# Altium project DTCP v2.0.PrjPcb (part 1 of 2)
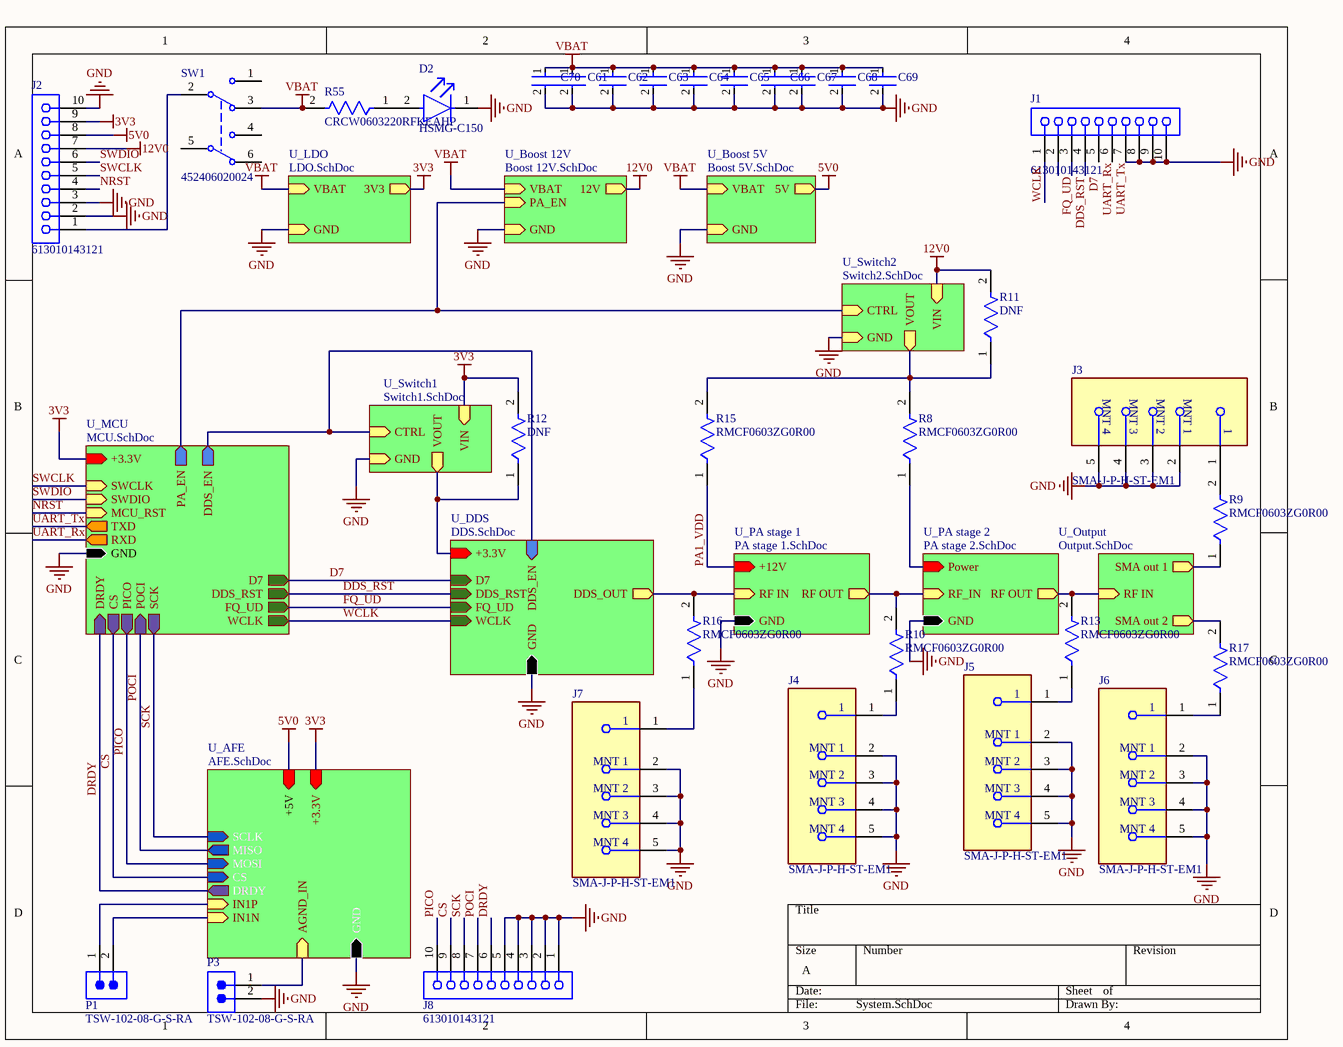
[diagram p0: System.SchDoc]
10 sheets, 150 parts. Net scope: hierarchical (ports join the sheet entries above them; power ports are global).
Board file: PCB1.PcbDoc
Sheets:
  System.SchDoc
    U_MCU = MCU.SchDoc
    U_DDS = DDS.SchDoc
    U_PA stage 1 = PA stage 1.SchDoc
    U_PA stage 2 = PA stage 2.SchDoc
    U_Output = Output.SchDoc
    U_Boost 12V = Boost 12V.SchDoc
    U_Switch1 = Switch1.SchDoc
    U_Boost 5V = Boost 5V.SchDoc
    U_AFE = AFE.SchDoc

## Sheet System.SchDoc
size A; SheetNumber: 1; SheetTotal: 12

### Parts
C61  GRM21BR60J107ME15K  [FP-GRM21B-0_2-e0_2_0_7-IPC_B]  (value not drawn)
C62  GRM21BR60J107ME15K  [FP-GRM21B-0_2-e0_2_0_7-IPC_B]  (value not drawn)
C63  GRM21BR60J107ME15K  [FP-GRM21B-0_2-e0_2_0_7-IPC_B]  (value not drawn)
C64  GRM21BR60J107ME15K  [FP-GRM21B-0_2-e0_2_0_7-IPC_B]  (value not drawn)
C65  GRM21BR60J107ME15K  [FP-GRM21B-0_2-e0_2_0_7-IPC_B]  (value not drawn)
C66  GRM21BR60J107ME15K  [FP-GRM21B-0_2-e0_2_0_7-IPC_B]  (value not drawn)
C67  GRM21BR60J107ME15K  [FP-GRM21B-0_2-e0_2_0_7-IPC_B]  (value not drawn)
C68  GRM21BR60J107ME15K  [FP-GRM21B-0_2-e0_2_0_7-IPC_B]  (value not drawn)
C69  GRM21BR60J107ME15K  [FP-GRM21B-0_2-e0_2_0_7-IPC_B]  (value not drawn)
C70  GRM21BR60J107ME15K  [FP-GRM21B-0_2-e0_2_0_7-IPC_B]  (value not drawn)
D2  HSMG-C150  [FP-HSMG-C150-MFG]
J1  613010143121  [613010143121]
J2  613010143121  [613010143121]
J3  SMA-J-P-H-ST-EM1  [FP-SMA-J-P-H-ST-EM1-MFG]
J4  SMA-J-P-H-ST-EM1  [FP-SMA-J-P-H-ST-EM1-MFG]
J5  SMA-J-P-H-ST-EM1  [FP-SMA-J-P-H-ST-EM1-MFG]
J6  SMA-J-P-H-ST-EM1  [FP-SMA-J-P-H-ST-EM1-MFG]
J7  SMA-J-P-H-ST-EM1  [FP-SMA-J-P-H-ST-EM1-MFG]
J8  613010143121  [613010143121]
P1  TSW-102-08-G-S-RA  [SMTC-TSW-102-08-X-S-RA]
P3  TSW-102-08-G-S-RA  [SMTC-TSW-102-08-X-S-RA]
R8  RMCF0603ZG0R00  [FP-RMCF0603-IPC_B]
R9  RMCF0603ZG0R00  [FP-RMCF0603-IPC_B]
R10  RMCF0603ZG0R00  [FP-RMCF0603-IPC_B]
R11  DNF  [FP-RMCF0603-IPC_B]
R12  DNF  [FP-RMCF0603-IPC_B]
R13  RMCF0603ZG0R00  [FP-RMCF0603-IPC_B]
R15  RMCF0603ZG0R00  [FP-RMCF0603-IPC_B]
R16  RMCF0603ZG0R00  [FP-RMCF0603-IPC_B]
R17  RMCF0603ZG0R00  [FP-RMCF0603-IPC_B]
R55  CRCW0603220RFKEAHP  [FP-CRCW0603-HPe3-IPC_A]
SW1  452406020024  [452406020024]

### Sub-sheets
U_AFE = AFE.SchDoc: +5V (in), GND (in), +3.3V (in), DRDY (out), CS (in), SCLK (in), MISO (out), MOSI (in), IN1P (in), IN1N (in), AGND_IN (in)
U_Boost 5V = Boost 5V.SchDoc: VBAT (in), GND (in), 5V (out)
U_Boost 12V = Boost 12V.SchDoc: VBAT (in), GND (in), 12V (out), PA_EN (in)
U_DDS = DDS.SchDoc: DDS_OUT (out), D7 (in), DDS_RST (in), FQ_UD (in), WCLK (in), +3.3V (in), GND (in), DDS_EN (in)
U_LDO = LDO.SchDoc (file not in this document): VBAT (in), GND (in), 3V3 (out)
U_MCU = MCU.SchDoc: +3.3V (in), GND (in), SWCLK (in), SWDIO (in), MCU_RST (in), TXD (out), CS (out), PICO (out), POCI (in), SCK (out), D7 (out), DDS_RST (out), FQ_UD (out), WCLK (out), PA_EN (out), DDS_EN (out), DRDY (in), RXD (out)
U_Output = Output.SchDoc: RF IN (in), SMA out 1 (out), SMA out 2 (out)
U_PA stage 1 = PA stage 1.SchDoc: RF IN (in), RF OUT (out), GND (in), +12V (in)
U_PA stage 2 = PA stage 2.SchDoc: GND (in), RF OUT (out), Power (in), RF_IN (in)
U_Switch1 = Switch1.SchDoc: VOUT (out), CTRL (in), GND (in), VIN (in)
U_Switch2 = Switch2.SchDoc (file not in this document): VIN (in), VOUT (out), CTRL (in), GND (in)

### Nets
3V3: J2.9 R12.2 ; sheet U_MCU/+3.3V, sheet U_LDO/3V3, sheet U_Switch1/VIN, sheet U_AFE/+3.3V
3V3DDS: R12.1 ; sheet U_DDS/+3.3V, sheet U_Switch1/VOUT
5V0: J2.8 ; sheet U_Boost 5V/5V, sheet U_AFE/+5V
12V0: J2.7 R11.2 ; sheet U_Boost 12V/12V, sheet U_Switch2/VIN
13V0PA: R8.1 ; sheet U_PA stage 2/Power
GND: C61.2 C62.2 C63.2 C64.2 C65.2 C66.2 C67.2 C68.2 C69.2 C70.2 D2.1(C) J1.7 J1.8 J1.9 J1.10 J2.2 J2.3 J2.10 J3.2(MNT_1) J3.3(MNT_2) J3.4(MNT_3) J3.5(MNT_4) J4.2(MNT_1) J4.3(MNT_2) J4.4(MNT_3) J4.5(MNT_4) J5.2(MNT_1) J5.3(MNT_2) J5.4(MNT_3) J5.5(MNT_4) J6.2(MNT_1) J6.3(MNT_2) J6.4(MNT_3) J6.5(MNT_4) J7.2(MNT_1) J7.3(MNT_2) J7.4(MNT_3) J7.5(MNT_4) J8.1 J8.2 J8.3 J8.4 J8.5 P3.2 ; sheet U_MCU/GND, sheet U_DDS/GND, sheet U_PA stage 1/GND, sheet U_PA stage 2/GND, sheet U_LDO/GND, sheet U_Boost 12V/GND, sheet U_Switch1/GND, sheet U_Switch2/GND, sheet U_Boost 5V/GND, sheet U_AFE/GND
VBAT: C61.1 C62.1 C63.1 C64.1 C65.1 C66.1 C67.1 C68.1 C69.1 C70.1 R55.2 SW1.3 ; sheet U_LDO/VBAT, sheet U_Boost 12V/VBAT, sheet U_Boost 5V/VBAT
CS: J8.9 ; sheet U_MCU/CS, sheet U_AFE/CS
D7: J1.4 ; sheet U_MCU/D7, sheet U_DDS/D7
DDS_OUT: R16.2 ; sheet U_DDS/DDS_OUT, sheet U_PA stage 1/RF IN
DDS_RST: J1.3 ; sheet U_MCU/DDS_RST, sheet U_DDS/DDS_RST
DRDY: J8.6 ; sheet U_MCU/DRDY, sheet U_AFE/DRDY
FQ_UD: J1.2 ; sheet U_MCU/FQ_UD, sheet U_DDS/FQ_UD
IN+: P1.1 ; sheet U_AFE/IN1P
IN-: P1.2 ; sheet U_AFE/IN1N
NRST: J2.4 ; sheet U_MCU/MCU_RST
PA1_VDD: R15.1 ; sheet U_PA stage 1/+12V
PICO: J8.10 ; sheet U_MCU/PICO, sheet U_AFE/MOSI
POCI: J8.7 ; sheet U_MCU/POCI, sheet U_AFE/MISO
SCK: J8.8 ; sheet U_MCU/SCK, sheet U_AFE/SCLK
SWCLK: J2.5 ; sheet U_MCU/SWCLK
SWDIO: J2.6 ; sheet U_MCU/SWDIO
UART_Rx: J1.5 ; sheet U_MCU/RXD
UART_Tx: J1.6 ; sheet U_MCU/TXD  [project net TXD]
WCLK: J1.1 ; sheet U_MCU/WCLK, sheet U_DDS/WCLK  [project net DDS_WCLK]
NetC33_2: R10.2 ; sheet U_PA stage 1/RF OUT, sheet U_PA stage 2/RF_IN
NetC40_2: R13.2 ; sheet U_PA stage 2/RF OUT, sheet U_Output/RF IN
NetD2_2: D2.2(A) R55.1
NetJ2_1: J2.1 SW1.2(COM)
NetJ3_1: J3.1 R9.2
NetJ4_1: J4.1 R10.1
NetJ5_1: J5.1 R13.1
NetJ6_1: J6.1 R17.1
NetJ7_1: J7.1 R16.1
NetL14_1: R9.1 ; sheet U_Output/SMA out 1
NetL15_1: R17.2 ; sheet U_Output/SMA out 2
NetP3_1: P3.1 ; sheet U_AFE/AGND_IN
NetR8_2: R8.2 R11.1 R15.2 ; sheet U_Switch2/VOUT
NetR14_1: sheet U_MCU/PA_EN, sheet U_Boost 12V/PA_EN, sheet U_Switch2/CTRL
NetU1_8: sheet U_MCU/DDS_EN, sheet U_DDS/DDS_EN, sheet U_Switch1/CTRL

Not connected (* = marked no-connect by the designer): SW1 1 4 5(COM) 6

### Library data of the parts
C61-C70 = CMP-06035-052658-1: Chip Multilayer Ceramic Capacitors for General Purpose, 0805, 100uF, X5R, 15%, 20%, 6.3V; Voltage Rating (DC): 6.3V; Lead Free: Lead Free; Length: 2mm; Tolerance: 20%; Width: 1.25mm; Capacitance: 100uF; Dielectric: X5R; Thickness: 1.25mm
D2 = CMP-2000-05061-2: LED GREEN DIFFUSED 1206 SMD; Manufacturer: Broadcom; Led Orientation: Top View; Max Junction Temp: +95°C; Peak Emmision Wavelength: 570nm; Viewing Angle: 170°; Wavelength: 572nm; Reverse Voltage: 5V; Luminous Intensity: 15mcd; Forward Voltage: 2.2V; Power Dissipation: 65mW; Forward Current: 20mA; ComponentLink2Description: Datasheet; Lead Free: Yes; Temperature Range Low: -40°C; Package: HSMG-C150; Digikey Description: LED GREEN DIFFUSED 1206 SMD; Mouser Description: LED Uni-Color Green 570nm 2-Pin Chip LED T/R; Manufacturer Part Number: HSMG-C150; Temperature Range High: +85°C; Device Class L1: Optoelectronics; Colour: Green; Category: Diode; Device Class L3: unset; RoHS: TRUE; Height: 1.2mm; ComponentLink2URL: https://docs.broadcom.com/docs/AV02-0551EN; Device Class L2: LEDs; Automotive: No; Ipc Land Pattern Name: DIOCP320160X55; Octopart: https://octopart.com/hsmg-c150-broadcom-71131304; Temperature: -40°C to +85°C
J1 J2 J8 = CMP-1502-01419-3: NexarPartId: 18818161; Operating Supply Voltage: 250V; Contact Resistance: 20mΩ; Gender: Female; Insulation Resistance: 1GΩ; Connector Type: Header, Socket; Insulation: Insulated; Current Rating: 3A; Number of Positions: 10; Pitch: 2.54mm; Number of Rows: 1; Number of Pins: 10; Voltage Rating: 250V; Length: 25.9mm; Contact Gender: Female; RoHS: Compliant; Contact Plating: Gold; Height: 8.5mm; Min Operating Temperature: -40°C; Contact Material: Copper; Number of Contacts: 10; REACH SVHC: Unknown; Mount: Through Hole; Lead Pitch: 2.54mm; Width: 25.9mm; Max Operating Temperature: 125°C; Flammability Rating: UL94 V-0; Termination: Through Hole; Color: Black; Housing Material: PBT
J3-J7 = CMP-02754-000006-1: CONN SMA JACK STR 50OHM EDGE MNT; Dielectric Material: PTFE; Center Contact Plating: Gold; Max Frequency: 6GHz; Body Material: Brass; Voltage Rating: 335V; Impedance: 50R; Package Quantity: 1; Case/Package: SMA; Max Operating Temperature: 125°C; Fastening Type: Threaded; Orientation: Straight; Depth: 13.33mm; RoHS Compliant: Yes; Length: 6.35mm; Insulation Material: Polytetrafluoroethylene; Termination: Solder; Min Operating Temperature: -65°C; Housing Color: Gold; Contact Plating: Gold; Contact Material: Copper; Connector Type: SMA; Mount: Edge; Series: SMA; Packaging: Tray; Body Plating: Gold; Radiation Hardening: No
P1 P3 = CMP-1024-00320-1: 0.025" SQ Post Header, Through-hole, Right Angle, -55 to 125 degC, 2.54 mm Pitch, 2-Pin, Male, RoHS; Manufacturer: Samtec; Pitch: 2.54 mm; Temperature Range: -55 to 125 degC; PackageDescription: .025[0.64] SQ. Post Terminal Strip Assembly; ComponentLink3Description: Package Specification; ComponentLink2Description: Datasheet; PackageReference: TSW-102-08-X-S-RA; ComponentLink1Description: Manufacturer URL; ComponentLink2URL: http://www.samtec.com/documents/webfiles/pdf/TSW_TH.PDF; PackageVersion: DM, 8/1988; RoHS: True; PartNumber: TSW-102-08-G-S-RA; Mounting Technology: Through-hole; Orientation: Right Angle; ComponentLink1URL: http://www.samtec.com; DatasheetVersion: F-214; ComponentLink3URL: http://www.samtec.com/documents/webfiles/cpdf/TSW-XXX-XX-XXX-X-XX-XXX-MKT.pdf
R8-R13 R15-R17 = CMP-26527-006412-1: 0Ω ±0 0.1W 0603 Thick Film Chip Resistor AEC-Q200 compliant; Max Power Dissipation: 100mW; Resistance: 0R; Width: 0.031inch; RoHS Compliant: Yes; Number of Terminations: 2; Case/Package: 0603; Contact Plating: Tin; Height: 0.022inch; Resistor Type: Thick Film; Mount: Surface Mount; Length: 0.061inch; Features: Automotive AEC-Q200; Series: RMCF; Max Operating Temperature: 155°C; Radiation Hardening: No; Min Operating Temperature: -55°C; Packaging: Tape and Reel
R55 = CMP-02407-003593-1: RES Thick Film, 220Ω, 1%, 0.33W, 100ppm/°C, 0603; Max Power Dissipation: 250mW; Voltage Rating (DC): 75V; Resistance: 220R; Radiation Hardening: No; Contact Plating: Tin; Length: 1.6mm; Depth: 0.85mm; Composition: Thick Film; Lead Free: Lead Free; Mount: Surface Mount; Package Quantity: 5000; Height: 0.45mm; Termination: SMD/SMT; Weight: 7.1E-05oz; Military Standard: Not; Number of Terminations: 2; Case Code (Metric): 1608; Max Operating Temperature: 155°C; Power Rating: 250mW; Tolerance: 1%; Temperature Coefficient: 100ppm/°C; Features: Automotive AEC-Q200; Case Code (Imperial): 0603; Width: 0.033inch; Min Operating Temperature: -55°C; Case/Package: 0603; Voltage Rating: 75V; Packaging: Tape and Reel
SW1 = CMP-03913-146831046-1: Ws-slsv_smt Mini Slide Switch Sa

## Sheet MCU.SchDoc
size A; SheetNumber: 2; SheetTotal: 12
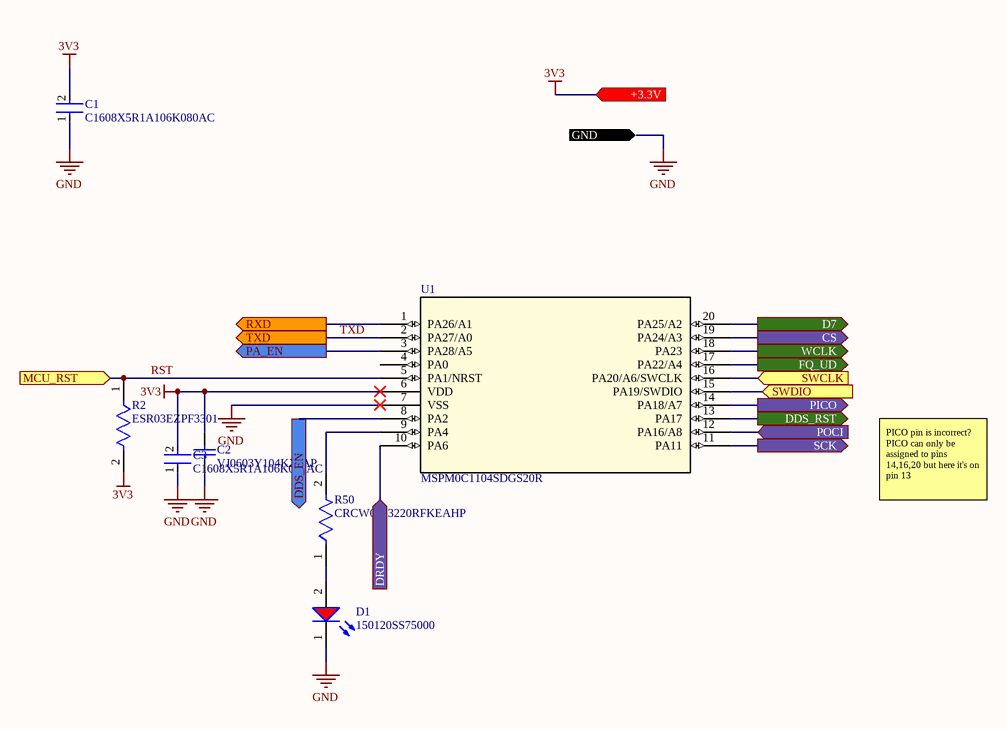
[diagram p1: MCU.SchDoc]

### Parts
C1  C1608X5R1A106K080AC  [FP-C1608-080-0_1-MFG]
C2  VJ0603Y104KXJAP  [CAPC1608X92X38NL15T08]
C3  C1608X5R1A106K080AC  [FP-C1608-080-0_1-MFG]
D1  150120SS75000  [WL-SMCW_1206_150120xx75000]
R2  ESR03EZPF3301  [FP-ESR03-IPC_A]
R50  CRCW0603220RFKEAHP  [FP-CRCW0603-HPe3-IPC_A]
U1  MSPM0C1104SDGS20R  [DGS0020A_TEX]

### Ports
+3.3V (in), CS (out), D7 (out), DDS_EN (out), DDS_RST (out), DRDY (in), FQ_UD (out), GND (in), MCU_RST (in), PA_EN (out), PICO (out), POCI (in), RXD (out), SCK (out), SWCLK (in), SWDIO (in), TXD (out), WCLK (out)

### Nets
3V3: C1.2 C2.2 C3.2 R2.2 U1.6(VDD) ; port +3.3V
GND: C1.1 C2.1 C3.1 D1.1(K) U1.7(VSS) ; port GND
CS: U1.19(PA24/A3) ; port CS
D7: U1.20(PA25/A2) ; port D7
DDS_RST: U1.13(PA17) ; port DDS_RST
DDS_WCLK: U1.18(PA23) ; port WCLK
DRDY: U1.10(PA6) ; port DRDY
FQ_UD: U1.17(PA22/A4) ; port FQ_UD
PICO: U1.14(PA18/A7) ; port PICO
POCI: U1.12(PA16/A8) ; port POCI
RST: R2.1 U1.5(PA1/NRST) ; port MCU_RST  [project net NRST]
SCK: U1.11(PA11) ; port SCK
SWCLK: U1.16(PA20/A6/SWCLK) ; port SWCLK
SWDIO: U1.15(PA19/SWDIO) ; port SWDIO
TXD: U1.2(PA27/A0) ; port TXD
UART_Rx: U1.1(PA26/A1) ; port RXD
NetD1_2: D1.2(A) R50.1
NetR14_1: U1.3(PA28/A5) ; port PA_EN
NetR50_2: R50.2 U1.9(PA4)
NetU1_8: U1.8(PA2) ; port DDS_EN

Not connected (* = marked no-connect by the designer): U1 4(PA0)

### Notes on the sheet
- PICO pin is incorrect? PICO can only be assigned to pins 14,16,20 but here it's on pin 13

### Library data of the parts
C1 C3 = CMP-2000-04979-3: Multilayer Ceramic Capacitors 10μF ±10% 10V X5R SMD 0603; Capacitance: 10uF; Dielectric Material: Ceramic; Construction: Flat; Height: 0.8mm; Thickness: 0.035inch; Case Code (Metric): 1608; Radiation Hardening: No; Number of Pins: 2; Voltage Rating (DC): 10V; Depth: 0.8mm; Voltage: 10V; RoHS Compliant: Yes; Voltage Rating: 10V; Package Quantity: 1; Resistor Type: Ceramic; Termination: SMD/SMT; Lead Free: Lead Free; REACH SVHC: No SVHC; Tolerance: 10%; Mount: Surface Mount; Series: C; Packaging: Tape and Reel; Width: 0.8mm; Dielectric: X5R; Weight: 7.1E-05oz; Length: 1.6mm; Max Operating Temperature: 85°C; Case Code (Imperial): 0603; Case/Package: 0603; Min Operating Temperature: -55°C
C2 = CMP-2006-01211-1: Manufacturer: Vitramon; Part Number: VJ0603Y104KXJAP
D1 = CMP-1426-00017-3: Led, Red, 630 Nm, 1.9 V, 30 Ma, 60 Mcd Rohs Compliant: Yes; Forward Current: 100mA; Max Reverse Voltage (DC): 5V; Lens Style: Clear, Rectangular; Viewing Angle: 140°; Luminous Intensity: 60mcd; Peak Wavelength: 645nm; Forward Voltage: 1.9V; Test Current: 20mA; Dominant Wavelength: 630nm; Case Code (Imperial): 1206; Length: 3.2mm; Mount: Surface Mount; Case Code (Metric): 3216; Case/Package: 1206; Min Operating Temperature: -40°C; Width: 1.6mm; Color: Red; Height: 680µm; REACH SVHC: Unknown; Max Operating Temperature: 85°C; Wavelength: 630nm; RoHS: Compliant; Packaging: Tape and Reel
R2 = CMP-08839-028747-1: 3.3kΩ ±1% 0.25W 0603 Anti-Surge Chip Resistor AEC-Q200; Temperature Coefficient: 100ppm/°C; Resistance: 3.3kR; Max Power Dissipation: 250mW; Tolerance: 1%; Min Operating Temperature: -55°C; Features: Automotive AEC-Q200; Max Operating Temperature: 155°C; Number of Terminations: 2; Series: ESR; Packaging: Tape and Reel; Resistor Type: Thick Film; RoHS Compliant: Yes; Case/Package: 0603
R50 = CMP-02407-003593-1: as R55 on sheet System; Radiation Hardening: No; Contact Plating: Tin; Length: 1.6mm; Depth: 0.85mm; Composition: Thick Film; Lead Free: Lead Free; Mount: Surface Mount; Package Quantity: 5000; Height: 0.45mm; Termination: SMD/SMT; Weight: 7.1E-05oz; Military Standard: Not; Number of Terminations: 2; Case Code (Metric): 1608; Max Operating Temperature: 155°C; Power Rating: 250mW; Tolerance: 1%; Temperature Coefficient: 100ppm/°C; Features: Automotive AEC-Q200; Case Code (Imperial): 0603; Width: 0.033inch; Min Operating Temperature: -55°C; Case/Package: 0603; Voltage Rating: 75V; Packaging: Tape and Reel
U1 = MSPM0C1104SDGS20R: 24MHz ArmÂ® CortexÂ®-M0+ MCU with 16KB flash, 1KB SRAM, 12-bit ADC 20-VSSOP -40 to 125; Manufacturer_Name: Texas Instruments; Copyright: Copyright (C) 2025 Ultra Librarian. All rights reserved.; Manufacturer_Part_Number: MSPM0C1104SDGS20R; Datasheet: https://www.ti.com/lit/gpn/mspm0c1104; RefDes: RefDes; Type: Type

## Sheet DDS.SchDoc
size A; SheetNumber: 5; SheetTotal: 12
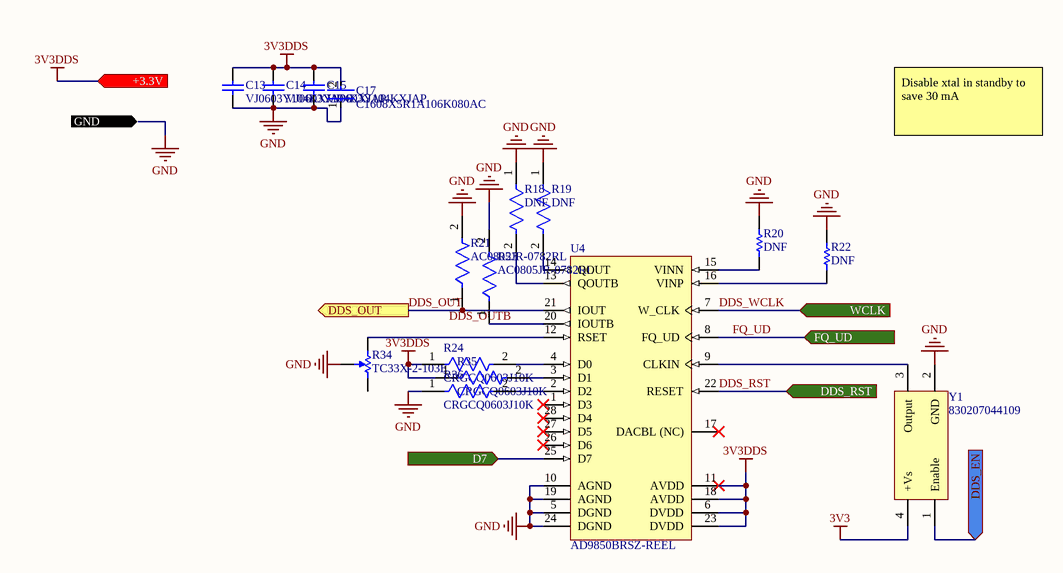
[diagram p2: DDS.SchDoc]

### Parts
C13  VJ0603Y104KXJAP  [CAPC1608X92X38NL15T08]
C14  VJ0603Y104KXJAP  [CAPC1608X92X38NL15T08]
C15  VJ0603Y104KXJAP  [CAPC1608X92X38NL15T08]
C17  C1608X5R1A106K080AC  [FP-C1608-080-0_1-MFG]
R18  DNF  [FP-RMCF0603-IPC_B]
R19  DNF  [FP-RMCF0603-IPC_B]
R20  DNF  [RESC0603(1608)_N]
R21  AC0805JR-0782RL  [FP-AC0805-MFG]
R22  DNF  [RESC0603(1608)_N]
R23  AC0805JR-0782RL  [FP-AC0805-MFG]
R24  CRGCQ0603J10K  [FP-CRGCQ0603-IPC_C]
R34  TC33X-2-103E  [BOUR-TC33X-2_V]
R35  CRGCQ0603J10K  [FP-CRGCQ0603-IPC_C]
R36  CRGCQ0603J10K  [FP-CRGCQ0603-IPC_C]
U4  AD9850BRSZ-REEL  [ADI-RS-28_N]
Y1  830207044109  [WE-SPXO_CFPS-39]

### Ports
+3.3V (in), D7 (in), DDS_EN (in), DDS_OUT (out), DDS_RST (in), FQ_UD (in), GND (in), WCLK (in)

### Nets
3V3: Y1.4(+Vs)
3V3DDS: C13.2 C14.2 C15.2 C17.2 R24.1 R35.1 U4.6(DVDD) U4.11(AVDD) U4.18(AVDD) U4.23(DVDD) ; port +3.3V
GND: C13.1 C14.1 C15.1 C17.1 R18.1 R19.1 R20.2 R21.2 R22.2 R23.2 R34.2 R36.1 U4.5(DGND) U4.10(AGND) U4.19(AGND) U4.24(DGND) Y1.2(GND) ; port GND
D7: U4.25(D7) ; port D7
DDS_OUT: R21.1 U4.21(IOUT) ; port DDS_OUT
DDS_RST: U4.22(RESET) ; port DDS_RST
DDS_WCLK: U4.7(W_CLK) ; port WCLK
FQ_UD: U4.8(FQ_UD) ; port FQ_UD
NetR18_2: R18.2 U4.13(QOUTB)
NetR19_2: R19.2 U4.14(QOUT)
NetR20_1: R20.1 U4.15(VINN)
NetR22_1: R22.1 U4.16(VINP)
NetR23_1: R23.1 U4.20(IOUTB)
NetR24_2: R24.2 U4.4(D0)
NetR34_1: R34.1 U4.12(RSET)
NetR35_2: R35.2 U4.3(D1)
NetR36_2: R36.2 U4.2(D2)
NetU1_8: Y1.1(Enable) ; port DDS_EN
NetU4_9: U4.9(CLKIN) Y1.3(Output)

Not connected (* = marked no-connect by the designer): R34 3; U4 1(D3)* 17(DACBL_(NC))* 26(D6)* 27(D5)* 28(D4)*

### Notes on the sheet
- Disable xtal in standby to save 30 mA
- Labels drawn without touching a wire or pin: DDS_OUTB

### Library data of the parts
C13-C15 = CMP-2006-01211-1: Manufacturer: Vitramon; Part Number: VJ0603Y104KXJAP
C17 = CMP-2000-04979-3: as C1 on sheet MCU; Dielectric Material: Ceramic; Construction: Flat; Height: 0.8mm; Thickness: 0.035inch; Case Code (Metric): 1608; Radiation Hardening: No; Number of Pins: 2; Voltage Rating (DC): 10V; Depth: 0.8mm; Voltage: 10V; RoHS Compliant: Yes; Voltage Rating: 10V; Package Quantity: 1; Resistor Type: Ceramic; Termination: SMD/SMT; Lead Free: Lead Free; REACH SVHC: No SVHC; Tolerance: 10%; Mount: Surface Mount; Series: C; Packaging: Tape and Reel; Width: 0.8mm; Dielectric: X5R; Weight: 7.1E-05oz; Length: 1.6mm; Max Operating Temperature: 85°C; Case Code (Imperial): 0603; Case/Package: 0603; Min Operating Temperature: -55°C
R18 R19 = CMP-26527-006412-1: as R8 on sheet System; Width: 0.031inch; RoHS Compliant: Yes; Number of Terminations: 2; Case/Package: 0603; Contact Plating: Tin; Height: 0.022inch; Resistor Type: Thick Film; Mount: Surface Mount; Length: 0.061inch; Features: Automotive AEC-Q200; Series: RMCF; Max Operating Temperature: 155°C; Radiation Hardening: No; Min Operating Temperature: -55°C; Packaging: Tape and Reel
R20 R22 = CMP-1012-00736-1: 100K 0.1W 1% 0603 (1608 Metric)  SMD; Value: 100000.00 Ohm; Case-Metric: 1608; Case-EIA: 0603; Power: 0.1 W; Tolerance: 1 %; Technology: SMT
R21 R23 = CMP-03412-037249-1: RES SMD 82 OHM 5% 1/8W 0805; Manufacturer: Yageo; Tolerance: 0.05; Value: 82Ω; Automotive Grade: Grade 0; Voltage Rating: 150V; Footprint Url: http://www.yageo.com/exep/pages/download/literatures/PYu-R_Mount_10.pdf; Ipc Land Pattern Name: RESC200125X50; Package: AC0805; Category: Res; Height: 0.6mm; Temperature Range High: +155°C; Digikey Description: RES SMD 82 OHM 5% 1/8W 0805; Device Class L2: Resistors; Power Rating: 1/8W; ComponentLink2URL: http://www.yageo.com/documents/recent/PYu-AC_51_RoHS_L_6.pdf; Mouser Description: Thick Film Resistors - SMD 1/8W 82ohm 5% AEC-Q200; Temperature: -55°C to +155°C; Octopart: https://octopart.com/ac0805jr-0782rl-yageo-71367939; Resistance: 82Ω; Composition: Thick Film; Device Class L3: Chip SMD Resistors; ComponentLink2Description: Datasheet; Device Class L1: Passive Components; Series: AC; Temperature Range Low: -55°C; RoHS: TRUE; Lead Free: Yes; Manufacturer Part Number: AC0805JR-0782RL; Automotive: Yes
R24 R35 R36 = CMP-03211-009884-1: CRGCQ 0603 10K 5%; Manufacturer: TE Connectivity; Tolerance: 0.05; Power Rating: 0.1W; Resistance: 10KΩ; Voltage Rating: 75V; Value: 10KΩ; Temperature Coefficient: ±100ppm/°C; Composition: Thick Film; ComponentLink2URL: https://www.te.com/commerce/DocumentDelivery/DDEController?Action=showdoc&DocId=Data+Sheet%7F1773204-3%7F1%7Fpdf%7FEnglish%7FENG_DS_1773204-3_1.pdf%7F4-2176339-923; Device Class L1: Passive Components; Package: CRGCQ0603; Mouser Description: Res Thick Film 0603 10K Ohm 5% 0.1W(1/10W) ±100ppm/C Pad SMD Automotive T/R; Temperature Range High: +155°C; Category: Res; Device Class L2: Resistors; Height: 0.55mm; RoHS: TRUE; Lead Free: Yes; Ipc Land Pattern Name: RESC16080X45; Temperature: -55°C to +155°C; Series: CRGCQ; Digikey Description: CRGCQ 0603 10K 5%; Octopart: https://octopart.com/crgcq0603j10k-te+connectivity-91018097; Device Class L3: Chip SMD Resistors; Ambient Temperature Range High: +70°C; ComponentLink2Description: Datasheet; Temperature Range Low: -55°C; Manufacturer Part Number: CRGCQ0603J10K
R34 = CMP-2100-03695-1: Trimming Potentiometer, 10000 Ohm, -40 to 100 degC, 3-Pin SMD, RoHS, Tape and Reel; Manufacturer: Bourns; Tolerance: 25%; Max Power Dissipation: 100mW; Number of Turns: 1; Resistance: 10KOhm; Temperature Coefficient: 250ppm/degreesC; Voltage Rating (DC): 50V; Datasheet URL: http://www.bourns.com/docs/Product-Datasheets/TC33.pdf; Composition: Potentiometer; Package Description: 3-Pin Surface Mount Device, Body 3.8 x 3.6 mm; Weight: 29.4mg; Power Rating: 100mW; Termination: FootPrint; Manufacturer URL: http://www.bourns.com/; Width: 0.118inch; Height: 0.047inch; Military Standard: Not; Radiation Hardening: No; Colour: Silver; Case/Package: SMD/SMT; Depth: 3.8mm; Min Operating Temperature: -40degC; Lead Free: LeadFree; Datasheet Version: 42583.0; REACH SVHC: NoSVHC; Length: 3mm; RoHSCompliant: true; Contact Plating: Silver; Taper: Linear; Packaging: TapeandReel; Mount: SurfaceMount; Max Operating Temperature: 100degC; Package Reference: TC33X-2; Package Quantity: 2500
U4 = CMP-0293-00041-1: CMOS, 125 MHz Complete DDS Synthesizer, 10-Bit, Parallel, Serial, RS-28, 1500 Reel, Pb-Free; Tuning Word Width (bits): 32bit; Master fclk: 125MHz; Resolution (Bits): 10bit; REFCLK Multiplier: No; Compliance Range (V): 1.5V; FS Iout (mA nom): 20mA; I Supply total (max): 96mA; ComponentLink3Description: Package Specification; Code_JEDEC: MO-150-AH; ComponentLink1URL: www.analog.com; I/O Interface: Parallel, Serial; PackageDescription: 28-Lead Shrink Small Outline Package [SSOP]; ComponentLink2URL: http://www.analog.com/static/imported-files/data_sheets/AD9850.pdf; ComponentLink3URL: http://www.analog.com/static/imported-files/packages/32122249223724RS_28.pdf; ComponentLink2Description: Datasheet; PackageVersion: revA, 1997; ComponentLink1Description: Manufacturer URL; PackageReference: RS-28; DatasheetVersion: Rev. H
Y1 = CMP-03913-116855802-1: 830207044109 WE-SPXO Crystal Oscillator; Frequency: 100MHz; NexarPartId: 116855802; Length: 3.2mm; Width: 2.5mm; Max Operating Temperature: 85°C; Height: 1.2mm; Min Operating Temperature: -40°C

## Sheet PA stage 1.SchDoc
size A; SheetNumber: 8; SheetTotal: 12
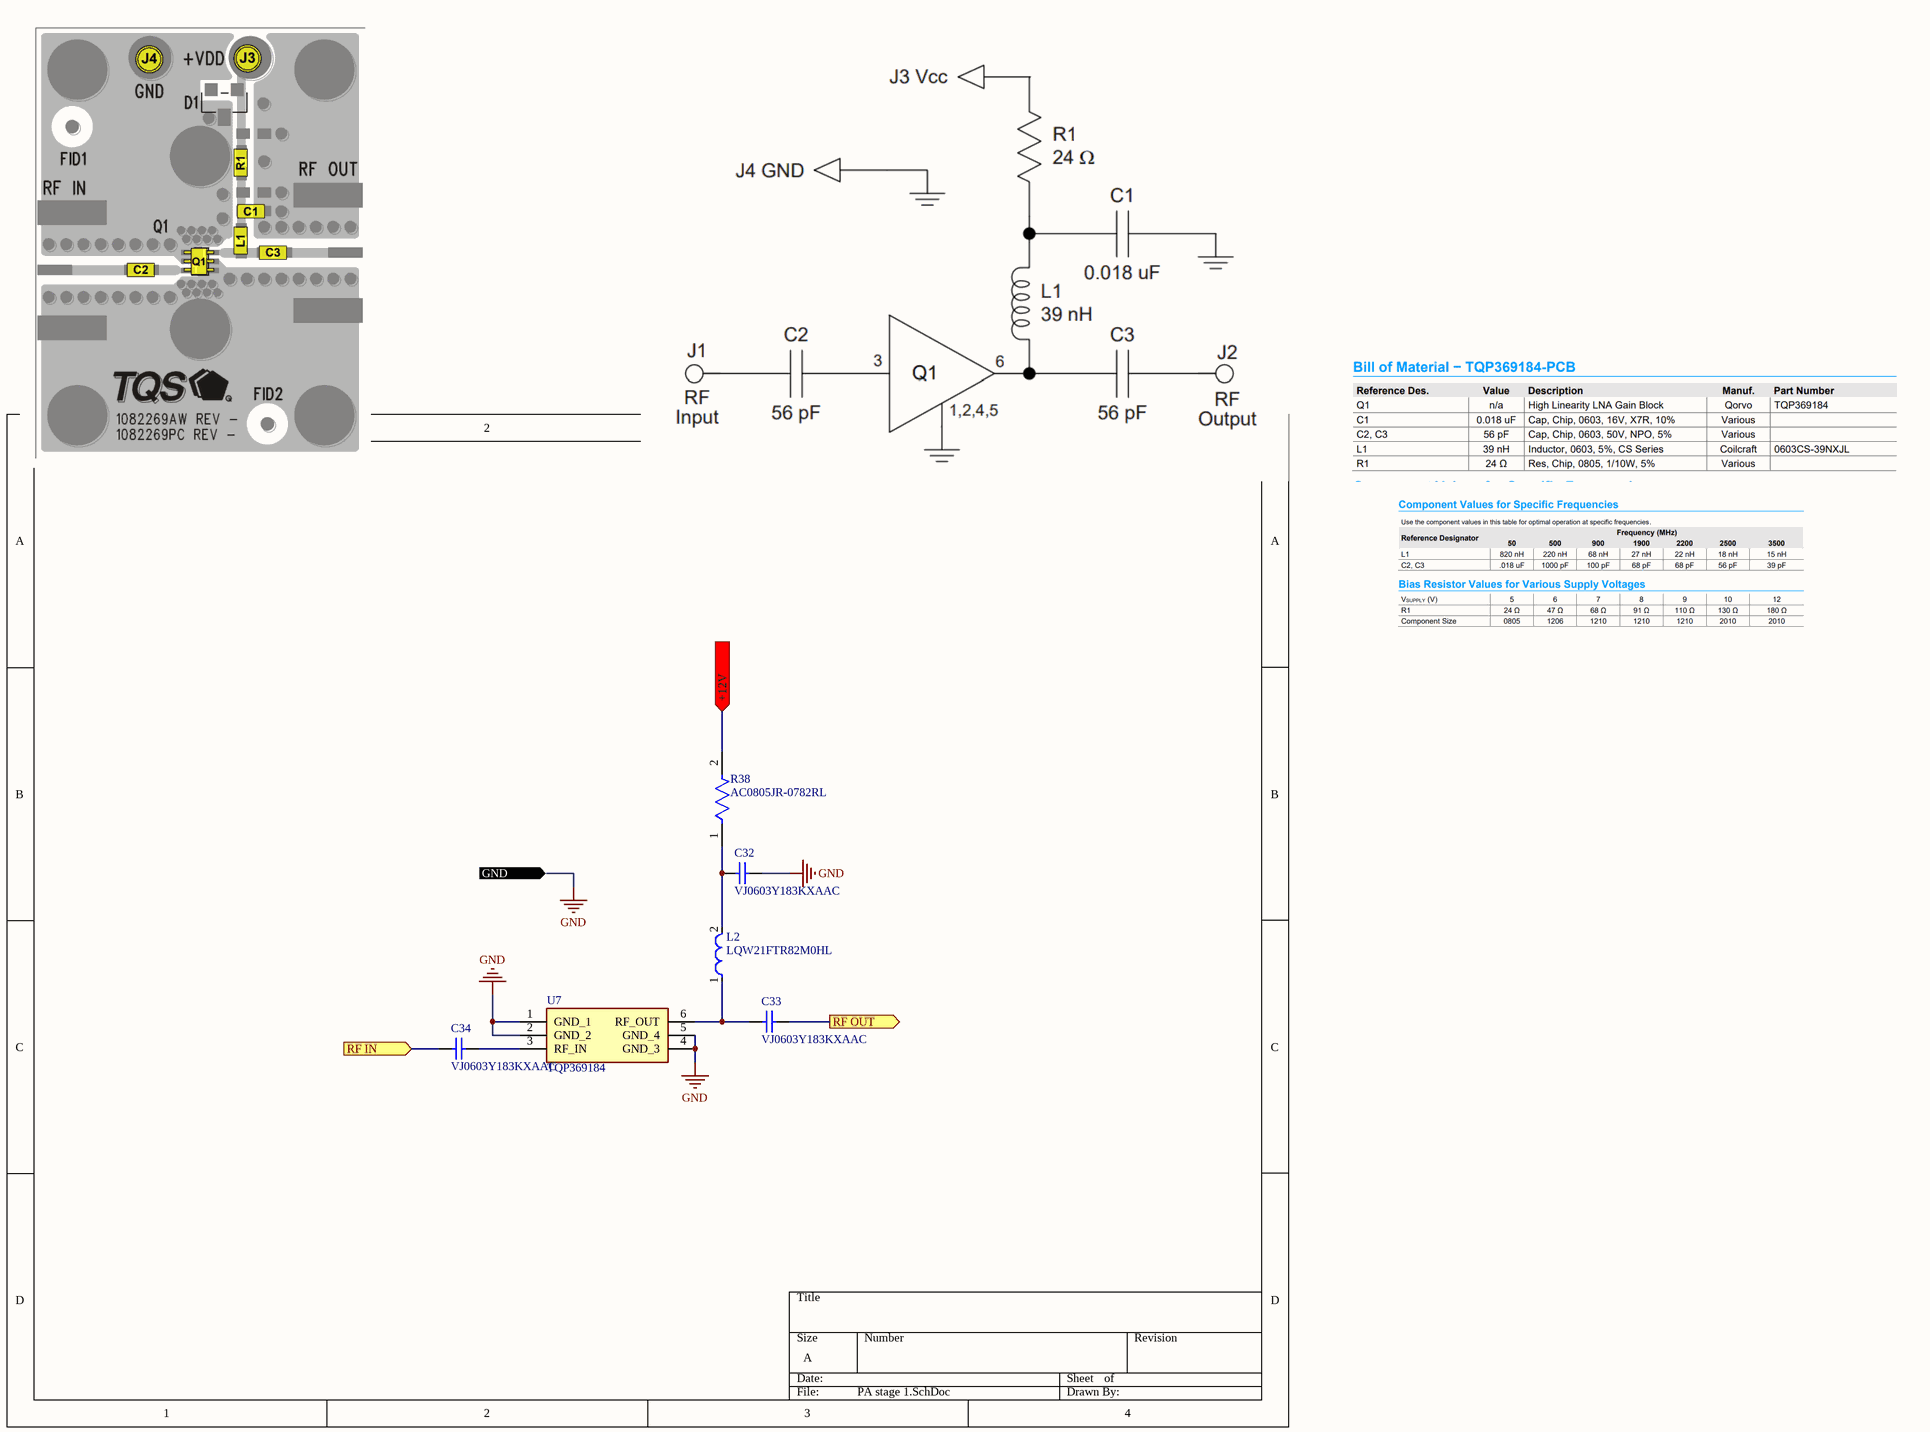
[diagram p3: PA stage 1.SchDoc]

### Parts
C32  VJ0603Y183KXAAC  [CAPC1608X92X38ML15T08]
C33  VJ0603Y183KXAAC  [CAPC1608X92X38ML15T08]
C34  VJ0603Y183KXAAC  [CAPC1608X92X38ML15T08]
L2  LQW21FTR82M0HL  [FP-LQW21FT_0H-MFG]
R38  AC0805JR-0782RL  [FP-AC0805-MFG]
U7  TQP369184  [SOT65P210X110-6N]

### Ports
+12V (in), GND (in), RF IN (in), RF OUT (out)

### Nets
GND: C32.2 U7.1(GND_1) U7.2(GND_2) U7.4(GND_3) U7.5(GND_4) ; port GND
DDS_OUT: C34.1 ; port RF IN
PA1_VDD: R38.2 ; port +12V
NetC32_1: C32.1 L2.2 R38.1
NetC33_1: C33.1 L2.1 U7.6(RF_OUT)
NetC33_2: C33.2 ; port RF OUT
NetC34_2: C34.2 U7.3(RF_IN)

### Library data of the parts
C32-C34 = CMP-2006-01326-1: Manufacturer: Vitramon; Part Number: VJ0603Y183KXAAC
L2 = CMP-06042-017060-1: FIXED IND 1UH 700MA POWRTRN
R38 = CMP-03412-037249-1: as R21 on sheet DDS; Footprint Url: http://www.yageo.com/exep/pages/download/literatures/PYu-R_Mount_10.pdf; Ipc Land Pattern Name: RESC200125X50; Package: AC0805; Category: Res; Height: 0.6mm; Temperature Range High: +155°C; Digikey Description: RES SMD 82 OHM 5% 1/8W 0805; Device Class L2: Resistors; Power Rating: 1/8W; ComponentLink2URL: http://www.yageo.com/documents/recent/PYu-AC_51_RoHS_L_6.pdf; Mouser Description: Thick Film Resistors - SMD 1/8W 82ohm 5% AEC-Q200; Temperature: -55°C to +155°C; Octopart: https://octopart.com/ac0805jr-0782rl-yageo-71367939; Resistance: 82Ω; Composition: Thick Film; Device Class L3: Chip SMD Resistors; ComponentLink2Description: Datasheet; Device Class L1: Passive Components; Series: AC; Temperature Range Low: -55°C; RoHS: TRUE; Lead Free: Yes; Manufacturer Part Number: AC0805JR-0782RL; Automotive: Yes
U7 = TQP369184: DC  6 GHz Gain Block; Manufacturer_Name: Qorvo; Geometry.Height: 1.1mm; Mouser Part Number: 772-TQP369184; Mouser Price/Stock: https://www.mouser.co.uk/ProductDetail/Qorvo/TQP369184?qs=opBjA1TV900HByuIeJCWsQ%3D%3D; Manufacturer_Part_Number: TQP369184; Datasheet Link: https://www.qorvo.com/products/d/da005471

## Sheet PA stage 2.SchDoc
size A; SheetNumber: 9; SheetTotal: 12
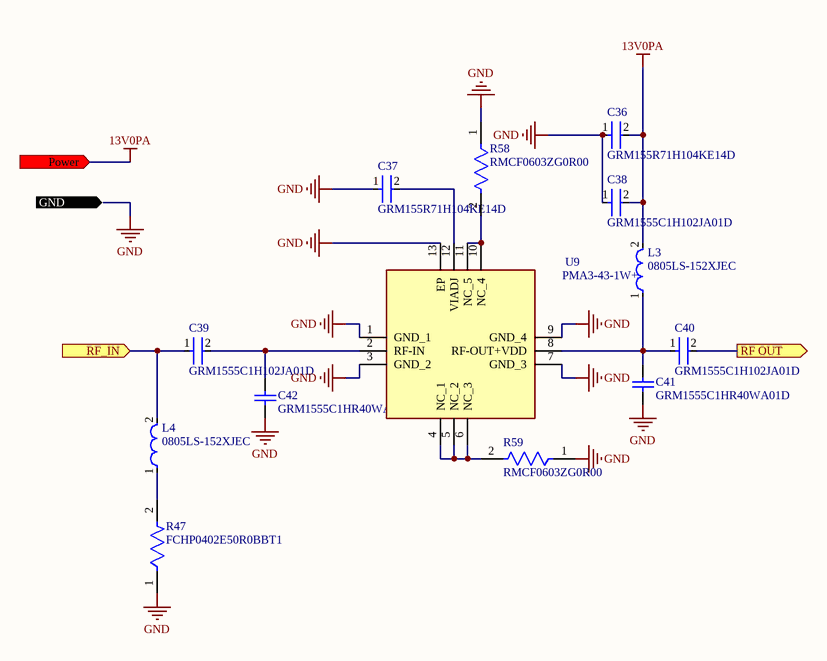
[diagram p4: PA stage 2.SchDoc]

### Parts
C36  GRM155R71H104KE14D  [FP-GRM155-0_05-IPC_B]
C37  GRM155R71H104KE14D  [FP-GRM155-0_05-IPC_B]
C38  GRM1555C1H102JA01D  [FP-GRM155-0_05-IPC_B]
C39  GRM1555C1H102JA01D  [FP-GRM155-0_05-IPC_B]
C40  GRM1555C1H102JA01D  [FP-GRM155-0_05-IPC_B]
C41  GRM1555C1HR40WA01D  [CAPC1005X55X25LL05T10]
C42  GRM1555C1HR40WA01D  [CAPC1005X55X25LL05T10]
L3  0805LS-152XJEC  [FP-LQW21HN_00-MFG]
L4  0805LS-152XJEC  [FP-LQW21HN_00-MFG]
R47  FCHP0402E50R0BBT1  [FP-FC0402-MFG]
R58  RMCF0603ZG0R00  [FP-RMCF0603-IPC_B]
R59  RMCF0603ZG0R00  [FP-RMCF0603-IPC_B]
U9  PMA3-43-1W+  [QFN51P300X300X89-13N]

### Ports
GND (in), Power (in), RF OUT (out), RF_IN (in)

### Nets
13V0PA: C36.2 C38.2 L3.2 ; port Power
GND: C36.1 C37.1 C38.1 C41.1 C42.1 R47.1 R58.1 R59.1 U9.1(GND_1) U9.3(GND_2) U9.7(GND_3) U9.9(GND_4) U9.13(EP) ; port GND
NetC33_2: C39.1 L4.2 ; port RF_IN
NetC37_2: C37.2 U9.12(VIADJ)
NetC39_2: C39.2 C42.2 U9.2(RF-IN)
NetC40_1: C40.1 C41.2 L3.1 U9.8(RF-OUT+VDD)
NetC40_2: C40.2 ; port RF OUT
NetL4_1: L4.1 R47.2
NetR58_2: R58.2 U9.10(NC_4) U9.11(NC_5)
NetR59_2: R59.2 U9.4(NC_1) U9.5(NC_2) U9.6(NC_3)

### Library data of the parts
C36 C37 = CMP-2008-04639-2: Chip Multilayer Ceramic Capacitors for General Purpose, 0402, 0.10uF, X7R, 15%, 10%, 50V; Dissipation Factor: 0.025%; Capacitance: 100nF; Weight: 0.000212oz; Thickness: 0.022inch; Voltage Rating (DC): 50V; Dielectric Material: Ceramic; Termination: SMD/SMT; Case/Package: 0402; Case Code (Imperial): 0402; Mount: Surface Mount; REACH SVHC: No SVHC; Resistor Type: Ceramic; Dielectric: X7R; Max Operating Temperature: 125°C; Voltage: 50V; Lead Free: Lead Free; Package Quantity: 10000; Packaging: Tape and Reel; Length: 1mm; Material: Ceramic; Height: 0.5mm; Depth: 0.5mm; Width: 0.5mm; Min Operating Temperature: -55°C; Tolerance: 10%; Case Code (Metric): 1005; Voltage Rating: 50V
C38-C40 = CMP-2008-04254-2: Chip Multilayer Ceramic Capacitors for General Purpose, 0402, 1000pF, C0G, 30ppm/°C, 5%, 50V; Insulation Resistance: 10GR; Capacitance: 1nF; Packaging: Tape and Reel; Lead Free: Lead Free; Tolerance: 5%; Temperature Coefficient: 30ppm/°C; Thickness: 0.022inch; Termination: SMD/SMT; Max Operating Temperature: 125°C; Height: 0.5mm; Package Quantity: 1; Radiation Hardening: No; Material: Ceramic; Case Code (Metric): 1005; Number of Pins: 2; Voltage Rating: 50V; Mount: Surface Mount; Voltage: 50V; Case/Package: 0402; Min Operating Temperature: -55°C; Dielectric Material: Ceramic; Width: 0.5mm; Depth: 0.5mm; Case Code (Imperial): 0402; REACH SVHC: No SVHC; Dielectric: C0G; Voltage Rating (DC): 50V; Length: 1mm
C41 C42 = CMP-1034-00010-2: Manufacturer: Murata; Part Number: GRM1555C1HR40WA01D
L3 L4 = CMP-06042-001639-1: 0805LS-152XJEC Coilcraft; Core Material: Ferrite; DC Current: 85mA; DC Resistance (DCR): 5.33R; Self Resonant Frequency: 350MHz; Shielding: Unshielded; Inductance: 1.5uH; Test Frequency: 10MHz; Tolerance: 5%; Q Factor: 35; Width: 0.047inch; Case Code (Metric): 2012; Current Rating: 85mA; Mount: Surface Mount; Max DC Current: 85mA; Length: 2mm; Height - Seated (Max): 0.039inch; Depth: 1.4mm; Min Operating Temperature: -40°C; Termination: SMD/SMT; Military Standard: Not; Radiation Hardening: No; Packaging: Tape and Reel; Resistor Type: Wirewound; Case/Package: 0805; Case Code (Imperial): 0805; Weight: 0.000282oz; Height: 0.9mm; Package Quantity: 3000; Max Operating Temperature: 85°C
R47 = CMP-05494-120702529-1: FCHP0402E50R0BBT1 SMD Chip Resistor, 50 Ohm, ± 0.1%, 1 W, 0402 [1005 Metric], Thin Film, High Frequency; Power Rating: 1W; Voltage Rating: 30V; Temperature Coefficient: 25ppm/°C; Resistance: 50Ω; Max Operating Temperature: 155°C; Min Operating Temperature: -55°C; Composition: Thin Film; Schedule B: 8533210045; Case/Package: 0402; Tolerance: 0.1%; Height: 419.1µm; NexarPartId: 120702529
R58 R59 = CMP-26527-006412-1: as R8 on sheet System; Width: 0.031inch; RoHS Compliant: Yes; Number of Terminations: 2; Case/Package: 0603; Contact Plating: Tin; Height: 0.022inch; Resistor Type: Thick Film; Mount: Surface Mount; Length: 0.061inch; Features: Automotive AEC-Q200; Series: RMCF; Max Operating Temperature: 155°C; Radiation Hardening: No; Min Operating Temperature: -55°C; Packaging: Tape and Reel
U9 = PMA3-43-1W+: Integrated Circuit; Manufacturer_Name: Mini-Circuits; Datasheet Link: https://www.minicircuits.com/pdfs/PMA3-43-1W+.pdf; Height: 0.89mm; Manufacturer_Part_Number: PMA3-43-1W+

## Sheet Output.SchDoc
size A; SheetNumber: 10; SheetTotal: 12
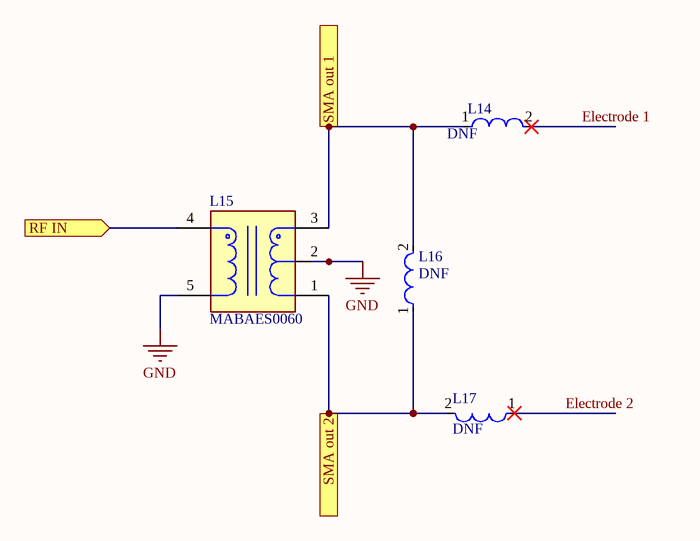
[diagram p5: Output.SchDoc]

### Parts
L14  DNF  [FP-MLZ2012-1_25-IPC_C]
L15  MABAES0060  [FP-MABAES0060-MFG]
L16  DNF  [FP-MLZ2012-1_25-IPC_C]
L17  DNF  [FP-MLZ2012-1_25-IPC_C]

### Ports
RF IN (in), SMA out 1 (out), SMA out 2 (out)

### Nets
GND: L15.2(Secondary_CT) L15.5(Primary)
Electrode 1: L14.2
Electrode 2: L17.1
NetC40_2: L15.4(Primary_dot) ; port RF IN
NetL14_1: L14.1 L15.3(Secondary_Dot) L16.2 ; port SMA out 1
NetL15_1: L15.1(Secondary) L16.1 L17.2 ; port SMA out 2

### Library data of the parts
L14 L16 L17 = CMP-08253-000383-1: Shielded Multilayer Inductor 1uH ±20% 800mA 130mΩ AEC-Q200 SMD 0805; Core Material: Ferrite; Test Frequency: 2MHz; DC Resistance (DCR): 130mR; Saturation Current: 700mA; Height: 1.25mm; Min Operating Temperature: -55°C; Max DC Current: 800mA; Mount: Surface Mount; Height - Seated (Max): 0.057inch; Tolerance: 20%; Package Quantity: 2000; Case/Package: 0805; Current Rating: 800mA; Inductance: 1uH; Case Code (Metric): 2012; Max Operating Temperature: 125°C; RoHS Compliant: Yes; Case Code (Imperial): 0805; Shielding: Shielded; Ratings: AEC-Q200; Length: 0.079inch; Termination: SMD/SMT; Packaging: Tape and Reel; Width: 0.049inch; Weight: 0.000194oz
L15 = CMP-97513-000003-1: BALUN 300KHZ-200MHZ 1:1 6SMD; Insertion Loss: 1.5dB; Lead/Base Style: Gull Wing; Max DC Current: 500mA; Power Rating: 500mW; Package Quantity: 2000; Lead Free: Lead Free; Case/Package: SMD/SMT; Number of Pins: 5; Width: 3.81mm; Turns Ratio: 1:1; Depth: 3.81mm; Height: 2.67mm; Min Operating Temperature: -40°C; Termination: SMD/SMT; Length: 3.81mm; Max Operating Temperature: 85°C; Packaging: Tape and Reel; Radiation Hardening: No; Mount: Surface Mount

## Sheet Boost 12V.SchDoc
size A4; SheetNumber: 3; SheetTotal: 12
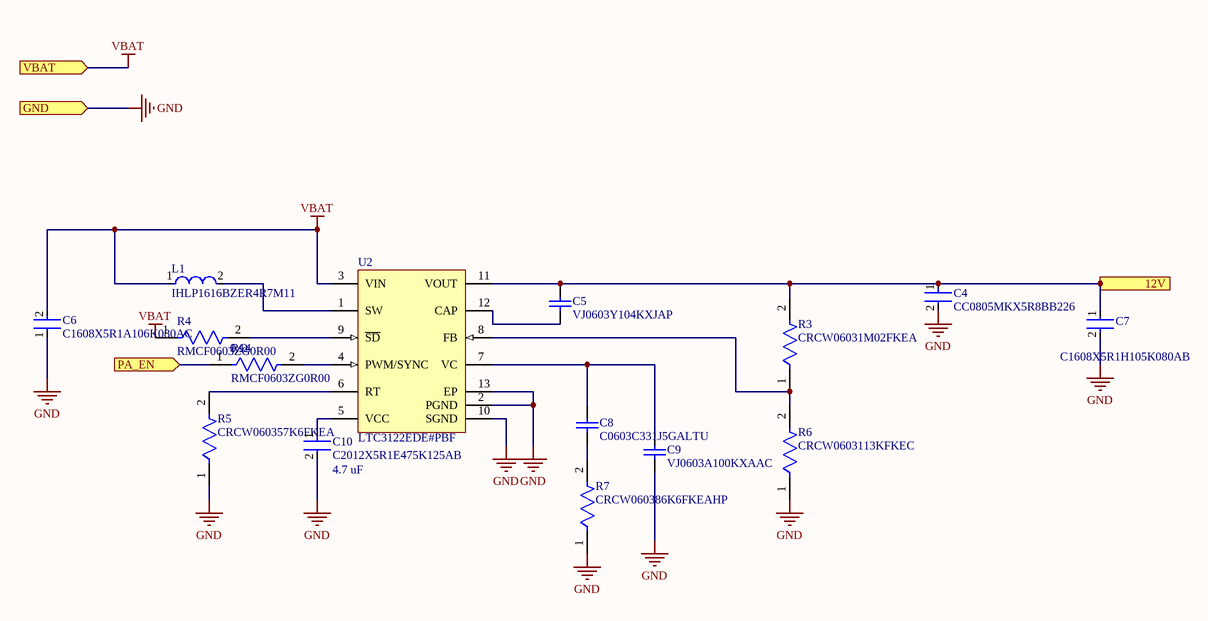
[diagram p6: Boost 12V.SchDoc]

### Parts
C4  CC0805MKX5R8BB226  [FP-CC0805-0_2-1_45-IPC_C]
C5  VJ0603Y104KXJAP  [CAPC1608X92X38NL15T08]
C6  C1608X5R1A106K080AC  [FP-C1608-080-0_1-MFG]
C7  C1608X5R1H105K080AB  [FP-C1608-080-0_1-IPC_B]
C8  C0603C331J5GALTU  [CAPC1608X87X35NL15T15]
C9  VJ0603A100KXAAC  [CAPC1608X92X38ML12T08]
C10  C2012X5R1E475K125AB  [FP-C2012-125-0_2-MFG]
L1  IHLP1616BZER4R7M11  [FP-IHLP-1616BZ-FP_1_8545x-MFG]
R3  CRCW06031M02FKEA  [FP-CRCW0603-e3-IPC_A]
R4  RMCF0603ZG0R00  [FP-RMCF0603-IPC_B]
R5  CRCW060357K6FKEA  [FP-CRCW0603-e3-MFG]
R6  CRCW0603113KFKEC  [FP-CRCW0603-e3-MFG]
R7  CRCW060386K6FKEAHP  [FP-CRCW0603-HPe3-MFG]
R14  RMCF0603ZG0R00  [FP-RMCF0603-IPC_B]
U2  LTC3122EDE#PBF  [LT-DE-UE-12_V]

### Ports
12V (out), GND (in), PA_EN (in), VBAT (in)

### Nets
12V0: C4.1 C5.2 C7.1 R3.2 U2.11(VOUT) ; port 12V
GND: C4.2 C6.1 C7.2 C9.1 C10.2 R5.1 R6.1 R7.1 U2.2(PGND) U2.10(SGND) U2.13(EP) ; port GND
VBAT: C6.2 L1.1 R4.1 U2.3(VIN) ; port VBAT
NetC5_1: C5.1 U2.12(CAP)
NetC8_1: C8.1 R7.2
NetC8_2: C8.2 C9.2 U2.7(VC)
NetC10_1: C10.1 U2.5(VCC)
NetL1_2: L1.2 U2.1(SW)
NetR3_1: R3.1 R6.2 U2.8(FB)
NetR4_2: R4.2 U2.9(~{SD})
NetR5_2: R5.2 U2.6(RT)
NetR14_1: R14.1 ; port PA_EN
NetR14_2: R14.2 U2.4(PWM/SYNC)

### Notes on the sheet
- 0 Ω
- (near C10) 4.7 uF

### Library data of the parts
C4 = CMP-03422-001497-1: CAP CER 22UF 25V X5R 0805; Tolerance: 20%; Max Operating Temperature: 85°C; Dielectric: X5R; Termination: SMD/SMT; Voltage Rating: 25V; Width: 0.049inch; Min Operating Temperature: -55°C; Case/Package: 0805; Lead Free: Lead Free; RoHS Compliant: Yes; Weight: 0.000194oz; Voltage Rating (DC): 25V; Capacitance: 22uF; Length: 0.079inch; Halogen Free: Halogen Free; Height: 1.25mm; Packaging: Tape and Reel; Package Quantity: 3000; Case Code (Metric): 2012; Thickness: 0.057inch; Case Code (Imperial): 0805; Mount: Surface Mount
C5 = CMP-2006-01211-1: Manufacturer: Vitramon; Part Number: VJ0603Y104KXJAP
C6 = CMP-2000-04979-3: as C1 on sheet MCU; Dielectric Material: Ceramic; Construction: Flat; Height: 0.8mm; Thickness: 0.035inch; Case Code (Metric): 1608; Radiation Hardening: No; Number of Pins: 2; Voltage Rating (DC): 10V; Depth: 0.8mm; Voltage: 10V; RoHS Compliant: Yes; Voltage Rating: 10V; Package Quantity: 1; Resistor Type: Ceramic; Termination: SMD/SMT; Lead Free: Lead Free; REACH SVHC: No SVHC; Tolerance: 10%; Mount: Surface Mount; Series: C; Packaging: Tape and Reel; Width: 0.8mm; Dielectric: X5R; Weight: 7.1E-05oz; Length: 1.6mm; Max Operating Temperature: 85°C; Case Code (Imperial): 0603; Case/Package: 0603; Min Operating Temperature: -55°C
C7 = CMP-2000-06025-2: Multilayer Ceramic Capacitors 1μF ±10% 50V X5R SMD 0603; Capacitance: 1uF; Lead Free: Lead Free; Height: 0.8mm; Mount: Surface Mount; Radiation Hardening: No; Thickness: 0.035inch; Length: 1.6mm; Max Operating Temperature: 85°C; REACH SVHC: No SVHC; Min Operating Temperature: -55°C; Construction: Flat; RoHS Compliant: Yes; Voltage Rating: 50V; Dielectric: X5R; Packaging: Tape and Reel; Termination: SMD/SMT; Voltage Rating (DC): 50V; Case Code (Imperial): 0603; Voltage: 50V; Width: 0.031inch; Weight: 7.1E-05oz; Depth: 0.8mm; Case Code (Metric): 1608; Series: C; Case/Package: 0603; Tolerance: 10%; Resistor Type: Ceramic; Number of Pins: 2; Dielectric Material: Ceramic; Package Quantity: 1
C8 = CMP-2006-03564-1: Manufacturer: Kemet; Part Number: C0603C331J5GALTU
C9 = CMP-2006-02012-1: Manufacturer: Vitramon; Part Number: VJ0603A100KXAAC
C10 = CMP-08246-004908-1: Multilayer Ceramic Capacitors 4.7μF ±10% 25V X5R SMD 0805; Capacitance: 4.7uF; Lead Free: Lead Free; Thickness: 0.057inch; Packaging: Tape and Reel; Min Operating Temperature: -55°C; RoHS Compliant: Yes; Dielectric: X5R; Weight: 0.000194oz; REACH SVHC: No SVHC; Voltage Rating (DC): 25V; Mount: Surface Mount; Resistor Type: Ceramic; Termination: SMD/SMT; Number of Pins: 2; Case Code (Imperial): 0805; Dielectric Material: Ceramic; Voltage: 25V; Voltage Rating: 25V; Case Code (Metric): 2012; Case/Package: 0805; Max Operating Temperature: 85°C; Height: 1.25mm; Tolerance: 10%; Depth: 1.25mm; Package Quantity: 1; Length: 2mm; Radiation Hardening: No; Width: 1.25mm
L1 = CMP-02424-000576-1: Fixed Inductors Commercial Low DCR Series SMT 4.7uH 1.7A 105mΩ 20%; Saturation Current: 1.75A; Test Frequency: 100kHz; Shielding: Shielded; Self Resonant Frequency: 29MHz; Core Material: Ferrite; DC Resistance (DCR): 105mR; Width: 4.06mm; Depth: 4.31mm; Height: 2mm; Inductance: 4.7uH; Case/Package: 1616; Max DC Current: 1.7A; Max Operating Temperature: 125°C; Inductance Tolerance: 20%; Current Rating: 1.7A; Package Quantity: 4000; Tolerance: 20%; Length: 4.7mm; Contact Plating: Tin; RMS Current (Irms): 1.7A; Packaging: Tape and Reel; Height - Seated (Max): 0.079inch; Military Standard: Not; Termination: SMD/SMT; Mount: Surface Mount; Number of Pins: 1616; Min Operating Temperature: -55°C; Lead Free: Lead Free; Radiation Hardening: No
R3 = CMP-2000-03018-2: RES Thick Film, 1.02MΩ, 1%, 0.1W, 100ppm/°C, 0603; Voltage Rating (DC): 75V; Power Rating: 100mW; Resistance: 1.02MR; Features: Automotive AEC-Q200; Depth: 0.85mm; Max Operating Temperature: 155°C; Tolerance: 1%; Package Quantity: 10; Length: 1.55mm; Mount: Surface Mount; Termination: SMD/SMT; Width: 0.033inch; Temperature Coefficient: 100ppm/°C; Min Operating Temperature: -55°C; Composition: Thick Film; Max Power Dissipation: 100mW; Case Code (Imperial): 0603; Case/Package: 0603; Voltage Rating: 75V; Contact Plating: Tin; Case Code (Metric): 1608; Weight: 7.1E-05oz; Lead Free: Lead Free; Height: 0.02inch; Military Standard: Not; Number of Terminations: 2; Radiation Hardening: No; Packaging: Tape and Reel
R4 R14 = CMP-26527-006412-1: as R8 on sheet System; Width: 0.031inch; RoHS Compliant: Yes; Number of Terminations: 2; Case/Package: 0603; Contact Plating: Tin; Height: 0.022inch; Resistor Type: Thick Film; Mount: Surface Mount; Length: 0.061inch; Features: Automotive AEC-Q200; Series: RMCF; Max Operating Temperature: 155°C; Radiation Hardening: No; Min Operating Temperature: -55°C; Packaging: Tape and Reel
R5 = CMP-2000-03475-2: RES Thick Film, 57.6kΩ, 1%, 0.1W, 100ppm/°C, 0603; Voltage Rating: 75V; Power Rating: 100mW; Resistance: 57.6kR; Case Code (Metric): 1608; Length: 1.55mm; Weight: 7.1E-05oz; Case/Package: 0603; Features: Automotive AEC-Q200; Contact Plating: Tin; Temperature Coefficient: 100ppm/°C; Number of Terminations: 2; Packaging: Tape and Reel; Package Quantity: 10; Max Power Dissipation: 100mW; Depth: 0.85mm; Height: 0.45mm; Tolerance: 1%; Radiation Hardening: No; Composition: Thick Film; Width: 0.85mm; Min Operating Temperature: -55°C; Case Code (Imperial): 0603; Termination: SMD/SMT; Number of Pins: 2; Max Operating Temperature: 155°C; Military Standard: Not
R6 = CMP-02407-003381-1: RES Thick Film, 113kΩ, 1%, 0.1W, 100ppm/°C, 0603; Power Rating: 100mW; Resistance: 113kR; Packaging: Tape and Reel; Width: 0.033inch; Lead Free: Lead Free; Case/Package: 0603; Height: 0.02inch; Length: 0.061inch; Max Power Dissipation: 100mW; Composition: Thick Film; Tolerance: 1%; Number of Terminations: 2; Max Operating Temperature: 155°C; Min Operating Temperature: -55°C; Temperature Coefficient: 100ppm/°C; Features: Automotive AEC-Q200; Package Quantity: 20000
R7 = CMP-02407-006337-1: RES Thick Film, 86.6kΩ, 1%, 0.33W, 100ppm/°C, 0603; Max Power Dissipation: 250mW; Resistance: 86.6kR; Tolerance: 1%; Width: 0.033inch; Package Quantity: 5000; Composition: Thick Film; Number of Terminations: 2; Height: 0.022inch; Length: 0.063inch; Temperature Coefficient: 100ppm/°C; Packaging: Tape and Reel; Features: Automotive AEC-Q200; Lead Free: Lead Free; Case/Package: 0603
U2 = CMP-0492-00369-1: 2.5 A Synchronous Step-Up DC/DC Converter with Output Disconnect, 12-pin SON (DE-UE-12), -40 to 125 degC, Pb-Free; Manufacturer: Linear Technology; Number of Outputs: 1; ComponentLink2URL: http://cds.linear.com/docs/en/datasheet/3122fa.pdf; ComponentLink1URL: http://www.linear.com/; Code_JEDEC: MO-229; ComponentLink2Description: Datasheet; ComponentLink1Description: Manufacturer URL; PackageReference: DE-UE-12; PackageVersion: Rev. D, 06/2010; ComponentLink3Description: Package Specification; PackageDescription: 12-Pin Plastic DFN, Body 4 x 3 mm, Pitch 0.5 mm; PartNumber: LTC3122EDE#PBF; ComponentLink3URL: http://cds.linear.com/docs/en/packaging/DFN_12_05-08-1695.pdf; Mounting Technology: Surface Mount; RoHS: TRUE; DatasheetVersion: Rev. A

## Sheet Switch1.SchDoc
size A; SheetNumber: 4; SheetTotal: 12
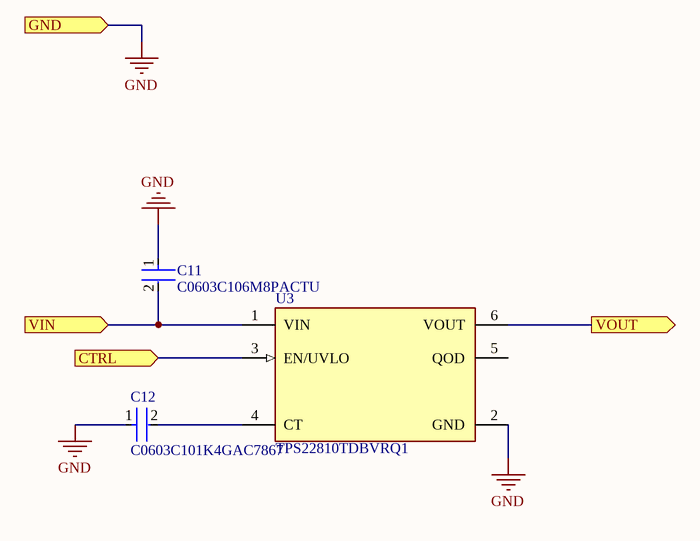
[diagram p7: Switch1.SchDoc]

### Parts
C11  C0603C106M8PACTU  [FP-C0603C106M8PACTU-MFG]
C12  C0603C101K4GAC7867  [FP-C0603C-CF-MFG]
U3  TPS22810TDBVRQ1  [FP-DBV0006A-MFG]

### Ports
CTRL (in), GND (in), VIN (in), VOUT (out)

### Nets
3V3: C11.2 U3.1(VIN) ; port VIN
3V3DDS: U3.6(VOUT) ; port VOUT
GND: C11.1 C12.1 U3.2(GND) ; port GND
NetC12_2: C12.2 U3.4(CT)
NetU1_8: U3.3(EN/UVLO) ; port CTRL

Not connected (* = marked no-connect by the designer): U3 5(QOD)

### Library data of the parts
C11 = CMP-03020-034654-1: CAP CER 10UF 10V X5R 0603; RoHS Compliant: Yes
C12 = CMP-03020-014723-2: CAP CER 100PF 16V NP0 0603; Manufacturer: KEMET; Automotive Grade: Grade 1; Material: Ceramic; Temperature Characteristic: C0G; Temperature Coefficient: 30ppm/°C; Tolerance: 0.1; Category: Cap; Temperature Range High: +125°C; RoHS: TRUE; Device Class L2: Capacitors; Automotive: Yes; Height: 0.87mm; Value: 100 pF; ComponentLink2Description: Datasheet; Digikey Description: CAP CER 100PF 16V NP0 0603; Manufacturer Part Number: C0603C101K4GAC7867; ComponentLink2URL: https://api.kemet.com/component-edge/download/datasheet/C0603C100J5GACAUTO.pdf; Device Class L1: Passive Components; Device Class L3: Ceramic Capacitors; Temperature: -55°C to +125°C; Lead Free: Yes; Capacitance: 100 pF; Temperature Range Low: -55°C; Voltage Rating: 16 V; Package: C0603C-CF; Octopart: https://octopart.com/c0603c101k4gac7867-kemet-1494535
U3 = CMP-04910-000007-2: IC PWR SWITCH N-CHAN 1:1 SOT23-6; Max Output Current: 2A; Max Supply Voltage: 18V; Min Supply Voltage: 2.7V; Number of Outputs: 1; Output Configuration: High Side; Fault Protection: Over Temperature; Interface: On/Off; Weight: 0.000801oz; Case/Package: SOT-23-6; Series: TPS22810-Q1; Package Quantity: 3000; RoHS Compliant: Yes; Number of Channels: 1; Max Operating Temperature: 105°C; Packaging: Cut Tape; Min Operating Temperature: -40°C

## Sheet Boost 5V.SchDoc
size A; SheetNumber: 12; SheetTotal: 12
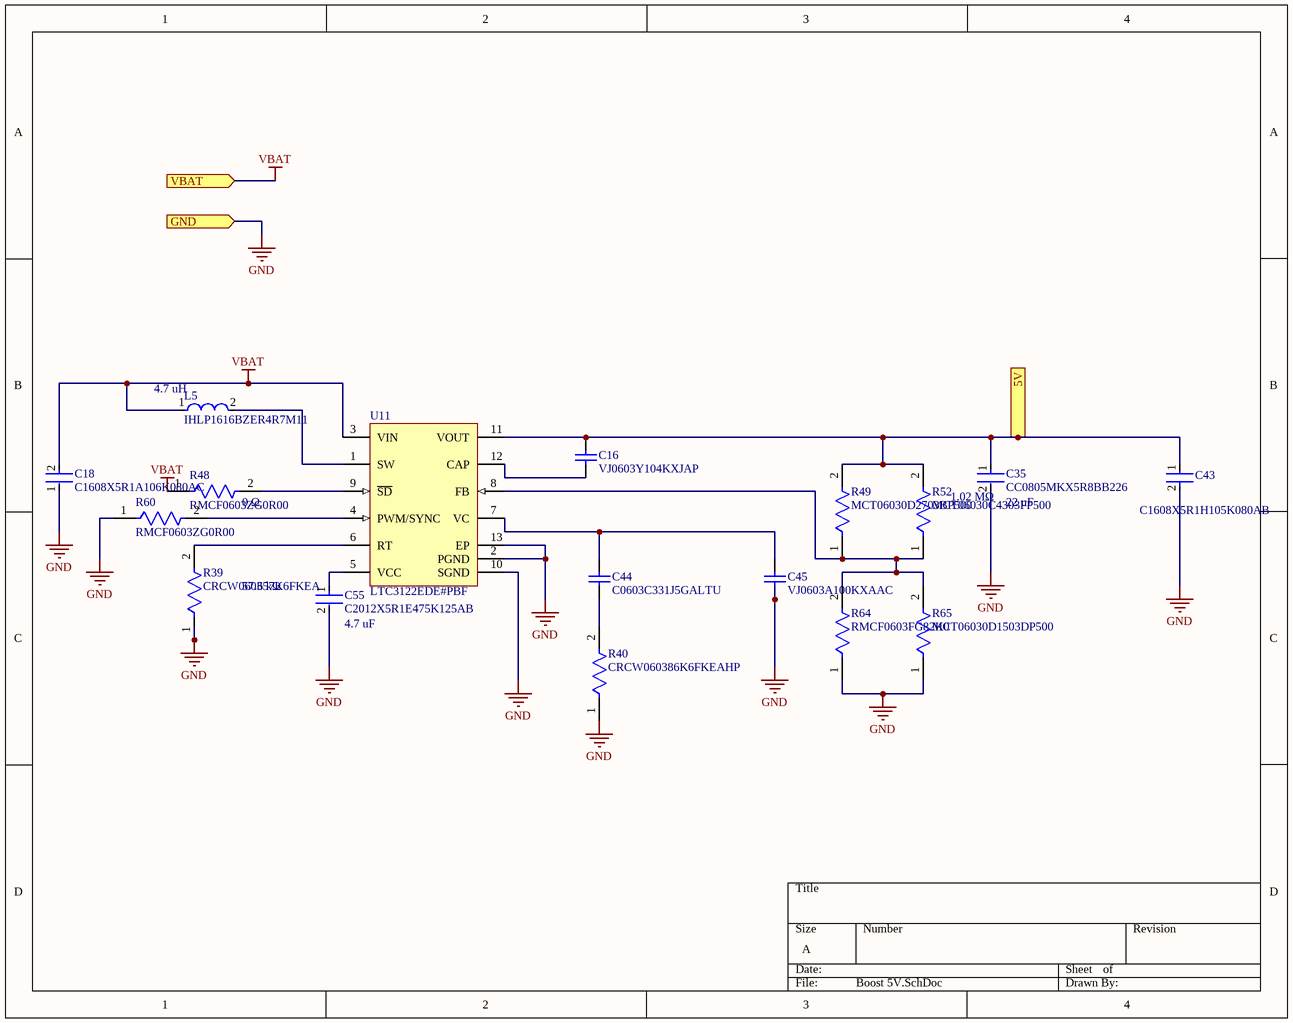
[diagram p8: Boost 5V.SchDoc]

### Parts
C16  VJ0603Y104KXJAP  [CAPC1608X92X38NL15T08]
C18  C1608X5R1A106K080AC  [FP-C1608-080-0_1-MFG]
C35  CC0805MKX5R8BB226  [FP-CC0805-0_2-1_45-IPC_C]
C43  C1608X5R1H105K080AB  [FP-C1608-080-0_1-IPC_B]
C44  C0603C331J5GALTU  [CAPC1608X87X35NL15T15]
C45  VJ0603A100KXAAC  [CAPC1608X92X38ML12T08]
C55  C2012X5R1E475K125AB  [FP-C2012-125-0_2-MFG]
L5  IHLP1616BZER4R7M11  [FP-IHLP-1616BZ-FP_1_8545x-MFG]
R39  CRCW060357K6FKEA  [FP-CRCW0603-e3-MFG]
R40  CRCW060386K6FKEAHP  [FP-CRCW0603-HPe3-MFG]
R48  RMCF0603ZG0R00  [FP-RMCF0603-IPC_B]
R49  MCT06030D2703BP500  [FP-MCT0603-IPC_A]
R52  MCT06030C4303FP500  [FP-MCT0603-IPC_A]
R60  RMCF0603ZG0R00  [FP-RMCF0603-IPC_B]
R64  RMCF0603FG82K0  [FP-RMCF0603-IPC_C]
R65  MCT06030D1503DP500  [FP-MCT0603-IPC_C]
U11  LTC3122EDE#PBF  [LT-DE-UE-12_V]

### Ports
5V (out), GND (in), VBAT (in)

### Nets
5V0: C16.2 C35.1 C43.1 R49.2 R52.2 U11.11(VOUT) ; port 5V
GND: C18.1 C35.2 C43.2 C45.1 C55.2 R39.1 R40.1 R60.1 R64.1 R65.1 U11.2(PGND) U11.10(SGND) U11.13(EP) ; port GND
VBAT: C18.2 L5.1 R48.1 U11.3(VIN) ; port VBAT
NetC16_1: C16.1 U11.12(CAP)
NetC44_1: C44.1 R40.2
NetC44_2: C44.2 C45.2 U11.7(VC)
NetC55_1: C55.1 U11.5(VCC)
NetL5_2: L5.2 U11.1(SW)
NetR39_2: R39.2 U11.6(RT)
NetR48_2: R48.2 U11.9(~{SD})
NetR49_1: R49.1 R52.1 R64.2 R65.2 U11.8(FB)
NetR60_2: R60.2 U11.4(PWM/SYNC)

### Notes on the sheet
- (near L5) 4.7 uH
- (near R48) 0 Ω
- (near C35) 1.02 MΩ
- (near C35) 22 uF
- 57.6 kΩ
- (near C55) 4.7 uF

### Library data of the parts
C16 = CMP-2006-01211-1: Manufacturer: Vitramon; Part Number: VJ0603Y104KXJAP
C18 = CMP-2000-04979-3: as C1 on sheet MCU; Dielectric Material: Ceramic; Construction: Flat; Height: 0.8mm; Thickness: 0.035inch; Case Code (Metric): 1608; Radiation Hardening: No; Number of Pins: 2; Voltage Rating (DC): 10V; Depth: 0.8mm; Voltage: 10V; RoHS Compliant: Yes; Voltage Rating: 10V; Package Quantity: 1; Resistor Type: Ceramic; Termination: SMD/SMT; Lead Free: Lead Free; REACH SVHC: No SVHC; Tolerance: 10%; Mount: Surface Mount; Series: C; Packaging: Tape and Reel; Width: 0.8mm; Dielectric: X5R; Weight: 7.1E-05oz; Length: 1.6mm; Max Operating Temperature: 85°C; Case Code (Imperial): 0603; Case/Package: 0603; Min Operating Temperature: -55°C
C35 = CMP-03422-001497-1: as C4 on sheet Boost 12V; Max Operating Temperature: 85°C; Dielectric: X5R; Termination: SMD/SMT; Voltage Rating: 25V; Width: 0.049inch; Min Operating Temperature: -55°C; Case/Package: 0805; Lead Free: Lead Free; RoHS Compliant: Yes; Weight: 0.000194oz; Voltage Rating (DC): 25V; Capacitance: 22uF; Length: 0.079inch; Halogen Free: Halogen Free; Height: 1.25mm; Packaging: Tape and Reel; Package Quantity: 3000; Case Code (Metric): 2012; Thickness: 0.057inch; Case Code (Imperial): 0805; Mount: Surface Mount
C43 = CMP-2000-06025-2: as C7 on sheet Boost 12V; Lead Free: Lead Free; Height: 0.8mm; Mount: Surface Mount; Radiation Hardening: No; Thickness: 0.035inch; Length: 1.6mm; Max Operating Temperature: 85°C; REACH SVHC: No SVHC; Min Operating Temperature: -55°C; Construction: Flat; RoHS Compliant: Yes; Voltage Rating: 50V; Dielectric: X5R; Packaging: Tape and Reel; Termination: SMD/SMT; Voltage Rating (DC): 50V; Case Code (Imperial): 0603; Voltage: 50V; Width: 0.031inch; Weight: 7.1E-05oz; Depth: 0.8mm; Case Code (Metric): 1608; Series: C; Case/Package: 0603; Tolerance: 10%; Resistor Type: Ceramic; Number of Pins: 2; Dielectric Material: Ceramic; Package Quantity: 1
C44 = CMP-2006-03564-1: Manufacturer: Kemet; Part Number: C0603C331J5GALTU
C45 = CMP-2006-02012-1: Manufacturer: Vitramon; Part Number: VJ0603A100KXAAC
C55 = CMP-08246-004908-1: as C10 on sheet Boost 12V; Lead Free: Lead Free; Thickness: 0.057inch; Packaging: Tape and Reel; Min Operating Temperature: -55°C; RoHS Compliant: Yes; Dielectric: X5R; Weight: 0.000194oz; REACH SVHC: No SVHC; Voltage Rating (DC): 25V; Mount: Surface Mount; Resistor Type: Ceramic; Termination: SMD/SMT; Number of Pins: 2; Case Code (Imperial): 0805; Dielectric Material: Ceramic; Voltage: 25V; Voltage Rating: 25V; Case Code (Metric): 2012; Case/Package: 0805; Max Operating Temperature: 85°C; Height: 1.25mm; Tolerance: 10%; Depth: 1.25mm; Package Quantity: 1; Length: 2mm; Radiation Hardening: No; Width: 1.25mm
L5 = CMP-02424-000576-1: as L1 on sheet Boost 12V; Width: 4.06mm; Depth: 4.31mm; Height: 2mm; Inductance: 4.7uH; Case/Package: 1616; Max DC Current: 1.7A; Max Operating Temperature: 125°C; Inductance Tolerance: 20%; Current Rating: 1.7A; Package Quantity: 4000; Tolerance: 20%; Length: 4.7mm; Contact Plating: Tin; RMS Current (Irms): 1.7A; Packaging: Tape and Reel; Height - Seated (Max): 0.079inch; Military Standard: Not; Termination: SMD/SMT; Mount: Surface Mount; Number of Pins: 1616; Min Operating Temperature: -55°C; Lead Free: Lead Free; Radiation Hardening: No
R39 = CMP-2000-03475-2: as R5 on sheet Boost 12V; Case Code (Metric): 1608; Length: 1.55mm; Weight: 7.1E-05oz; Case/Package: 0603; Features: Automotive AEC-Q200; Contact Plating: Tin; Temperature Coefficient: 100ppm/°C; Number of Terminations: 2; Packaging: Tape and Reel; Package Quantity: 10; Max Power Dissipation: 100mW; Depth: 0.85mm; Height: 0.45mm; Tolerance: 1%; Radiation Hardening: No; Composition: Thick Film; Width: 0.85mm; Min Operating Temperature: -55°C; Case Code (Imperial): 0603; Termination: SMD/SMT; Number of Pins: 2; Max Operating Temperature: 155°C; Military Standard: Not
R40 = CMP-02407-006337-1: as R7 on sheet Boost 12V; Tolerance: 1%; Width: 0.033inch; Package Quantity: 5000; Composition: Thick Film; Number of Terminations: 2; Height: 0.022inch; Length: 0.063inch; Temperature Coefficient: 100ppm/°C; Packaging: Tape and Reel; Features: Automotive AEC-Q200; Lead Free: Lead Free; Case/Package: 0603
R48 R60 = CMP-26527-006412-1: as R8 on sheet System; Width: 0.031inch; RoHS Compliant: Yes; Number of Terminations: 2; Case/Package: 0603; Contact Plating: Tin; Height: 0.022inch; Resistor Type: Thick Film; Mount: Surface Mount; Length: 0.061inch; Features: Automotive AEC-Q200; Series: RMCF; Max Operating Temperature: 155°C; Radiation Hardening: No; Min Operating Temperature: -55°C; Packaging: Tape and Reel
R49 = CMP-02407-001035-1: RES SMD 100 OHM 1% 1/8W 0603
R52 = CMP-02407-000140-1: RES SMD 100 OHM 1% 1/8W 0603; Temperature Coefficient: 50ppm/°C; Resistance: 430kR; Packaging: Tape and Reel; Min Operating Temperature: -55°C; Depth: 0.85mm; Max Operating Temperature: 125°C; Tolerance: 1%; Case/Package: 0603; Lead Free: Lead Free; Contact Plating: Tin; Radiation Hardening: No; Composition: Thin Film; Length: 1.55mm; Military Standard: Not
R64 = CMP-26527-006203-1: 82kΩ ±1% 0.1W 0603 Thick Film Chip Resistor AEC-Q200 compliant; Max Power Dissipation: 100mW; Resistance: 82kR; Temperature Coefficient: 100ppm/°C; Series: RMCF; Features: Automotive AEC-Q200; Height: 0.022inch; RoHS Compliant: Yes; Radiation Hardening: No; Number of Terminations: 2; Max Operating Temperature: 155°C; Width: 0.031inch; Mount: Surface Mount; Contact Plating: Tin; Packaging: Tape and Reel; Package Quantity: 10000; Resistor Type: Thick Film; Case/Package: 0603; Length: 0.061inch; Min Operating Temperature: -55°C; Tolerance: 1%
R65 = CMP-02407-001306-1: RES SMD 100 OHM 1% 1/8W 0603; Tolerance: 0.5%; Max Power Dissipation: 125mW; Temperature Coefficient: 25ppm/°C; Resistance: 150kR; Packaging: Tape and Reel; Width: 0.033inch; Package Quantity: 5000; Case/Package: 0603; Min Operating Temperature: -55°C; Composition: Thin Film; Max Operating Temperature: 155°C; Number of Terminations: 2; Height: 0.022inch; Lead Free: Lead Free; Length: 0.061inch
U11 = CMP-0492-00369-1: as U2 on sheet Boost 12V; ComponentLink2URL: http://cds.linear.com/docs/en/datasheet/3122fa.pdf; ComponentLink1URL: http://www.linear.com/; Code_JEDEC: MO-229; ComponentLink2Description: Datasheet; ComponentLink1Description: Manufacturer URL; PackageReference: DE-UE-12; PackageVersion: Rev. D, 06/2010; ComponentLink3Description: Package Specification; PackageDescription: 12-Pin Plastic DFN, Body 4 x 3 mm, Pitch 0.5 mm; PartNumber: LTC3122EDE#PBF; ComponentLink3URL: http://cds.linear.com/docs/en/packaging/DFN_12_05-08-1695.pdf; Mounting Technology: Surface Mount; RoHS: TRUE; DatasheetVersion: Rev. A